# Altium schematic sheet Peripherals.SchDoc
size A4; Revision: B.2
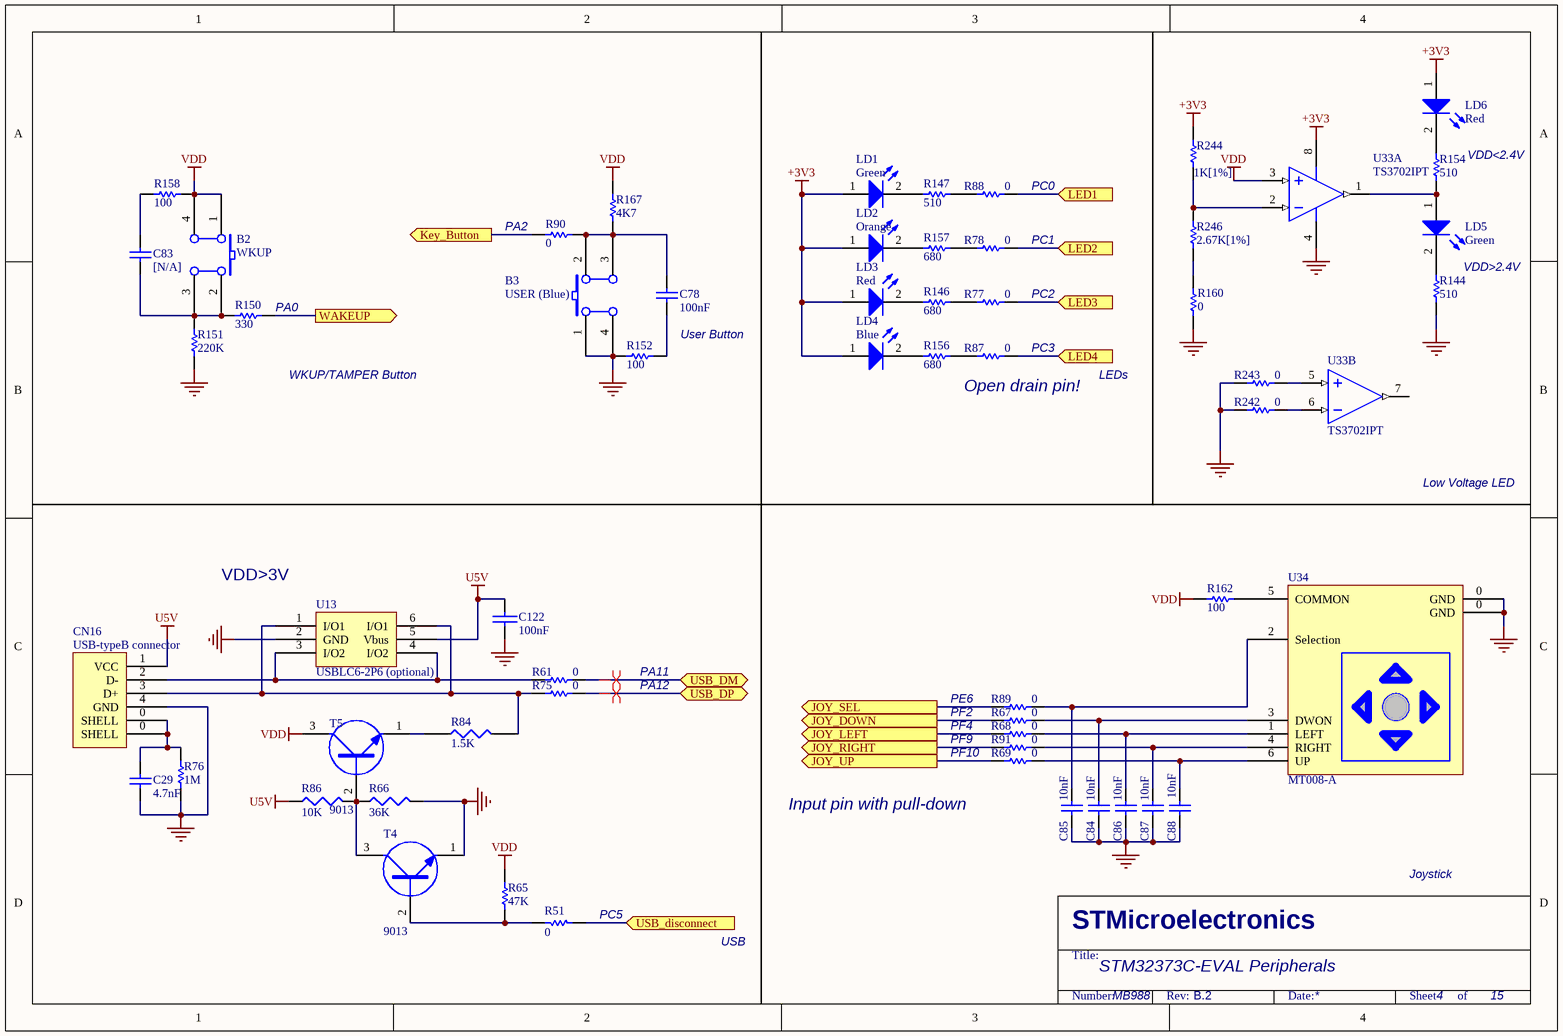
[diagram p0: Peripherals.SchDoc]

## Parts
B2  WKUP  [PB10]
B3  USER (Blue)  [PB10]
C29  4.7nF  [0603C]
C78  100nF  [0603C]
C83  [N/A]  [0603C]
C84  10nF  [0603C]
C85  10nF  [0603C]
C86  10nF  [0603C]
C87  10nF  [0603C]
C88  10nF  [0603C]
C122  100nF  [0603C]
CN16  USB-typeB connector  [USB-B]
LD1  Green  [0603D]
LD2  Orange  [0603D]
LD3  Red  [0603D]
LD4  Blue  [0603D]
LD5  Green  [0603D]
LD6  Red  [0603D]
R51  0  [0603R]
R61  0  [0603R]
R65  47K  [0603R]
R66  36K  [0603R]
R67  0  [0603R]
R68  0  [0603R]
R69  0  [0603R]
R75  0  [0603R]
R76  1M  [0603R]
R77  0  [0603R]
R78  0  [0603R]
R84  1.5K  [0603R]
R86  10K  [0603R]
R87  0  [0603R]
R88  0  [0603R]
R89  0  [0603R]
R90  0  [0603R]
R91  0  [0603R]
R144  510  [0603R]
R146  680  [0603R]
R147  510  [0603R]
R150  330  [0603R]
R151  220K  [0603R]
R152  100  [0603R]
R154  510  [0603R]
R156  680  [0603R]
R157  680  [0603R]
R158  100  [0603R]
R160  0  [0603R]
R162  100  [0603R]
R167  4K7  [0603R]
R242  0  [0603R]
R243  0  [0603R]
R244  1K[1%]  [0603R]
R246  2.67K[1%]  [0603R]
T4  9013  [SOT-23]
T5  9013  [SOT-23]
U13  USBLC6-2P6 (optional)  [SOT-666]
U33  TS3702IPT  [TSSOP8(6.4)]  (parts A,B of 2)
U34  MT008-A  [JOY]

## Ports
JOY_DOWN (out), JOY_LEFT (out), JOY_RIGHT (out), JOY_SEL (out), JOY_UP (out), Key_Button (out), LED1 (in), LED2 (in), LED3 (in), LED4 (in), USB_disconnect (in), USB_DM (bidir), USB_DP (bidir), WAKEUP (out)

## Nets
+3V3: LD1.1(A) LD2.1(A) LD3.1(A) LD4.1(A) LD6.1(A) R244.2 U33.8(V+)
GND: B3.1(A0) B3.4(A1) C29.1 C84.1 C85.1 C86.1 C87.1 C88.1 C122.2 CN16.4(GND) R66.2 R76.1 R144.2 R151.2 R152.1 R160.2 R242.2 R243.2 T4.1(E) U13.2(GND) U33.4(V-) U34.0(GND)
U5V: C122.1 CN16.1(VCC) R86.1 U13.5(Vbus)
VDD: B2.1(A0) B2.4(A1) R65.2 R158.1 R162.1 R167.2 T5.3(C) U33.3(IN+)
JOY_DOWN: R67.2 ; port JOY_DOWN
JOY_LEFT: R68.2 ; port JOY_LEFT
JOY_RIGHT: R91.2 ; port JOY_RIGHT
JOY_SEL: R89.2 ; port JOY_SEL
JOY_UP: R69.2 ; port JOY_UP
Key_Button: R90.2 ; port Key_Button
LED1: R88.1 ; port LED1
LED2: R78.1 ; port LED2
LED3: R77.1 ; port LED3
LED4: R87.1 ; port LED4
USB_disconnect: R51.2 ; port USB_disconnect
USB_DM: R61.1 ; port USB_DM
USB_DP: R75.1 ; port USB_DP
WAKEUP: R150.2 ; port WAKEUP
NetB2_2: B2.2(B0) B2.3(B1) C83.2 R150.1 R151.1
NetB3_2: B3.2(B0) B3.3(B1) C78.2 R90.1 R167.1
NetC29_2: C29.2 CN16.0(SHELL) R76.2
NetC78_1: C78.1 R152.2
NetC83_1: C83.1 R158.2
NetC84_2: C84.2 R67.1 U34.3(DWON)
NetC85_2: C85.2 R89.1 U34.2(Selection)
NetC86_2: C86.2 R68.1 U34.1(LEFT)
NetC87_2: C87.2 R91.1 U34.4(RIGHT)
NetC88_2: C88.2 R69.1 U34.6(UP)
NetCN16_2: CN16.2(D-) R61.2 U13.3(I/O2) U13.4(I/O2)
NetCN16_3: CN16.3(D+) R75.2 R84.2 U13.1(I/O1) U13.6(I/O1)
NetLD1_2: LD1.2(K) R147.2
NetLD2_2: LD2.2(K) R157.2
NetLD3_2: LD3.2(K) R146.2
NetLD4_2: LD4.2(K) R156.2
NetLD5_1: LD5.1(A) R154.2 U33.1(OUT)
NetLD5_2: LD5.2(K) R144.1
NetLD6_2: LD6.2(K) R154.1
NetR51_1: R51.1 R65.1 T4.2(B)
NetR66_1: R66.1 R86.2 T4.3(C) T5.2(B)
NetR77_2: R77.2 R146.1
NetR78_2: R78.2 R157.1
NetR84_1: R84.1 T5.1(E)
NetR87_2: R87.2 R156.1
NetR88_2: R88.2 R147.1
NetR160_1: R160.1 R246.1
NetR162_2: R162.2 U34.5(COMMON)
NetR242_1: R242.1 U33.6(IN-)
NetR243_1: R243.1 U33.5(IN+)
NetR244_1: R244.1 R246.2 U33.2(IN-)

Not connected (* = marked no-connect by the designer): U33 7(OUT)

## Layout directives
differential pair: USB_DM, USB_DP

## Notes on the sheet
- VDD<2.4V
- (near R90) PA2
- (near R88) PC0
- (near R78) PC1
- (near R150) PA0
- (near R77) PC2
- VDD>2.4V
- WKUP/TAMPER Button
- User Button
- (near R87) PC3
- LEDs
- Open drain pin!
- Low Voltage LED
- VDD>3V
- PA12
- PA11
- PF2
- PE6
- PF10
- PF9
- PF4
- Input pin with pull-down
- (near R51) PC5
- Joystick
- USB
- STM32373C-EVAL Peripherals
- MB988
- 4
- 15
- STMicroelectronics
- Title:
- Number:
- Rev:
- Date:
- Sheet       of

## Library data of the parts
B2 B3 = SW PUSHBUTTON: SE PUSHBUTTON
C29 C78 C83-C88 = CAP: Capacitor; Value: 100pF; Published: 8-Jun-2000; Revision: July-2002: Re-released for DXP Platform.; Publisher: Altium Limited
C122 = CAP: Capacitor
CN16 = USB-B
LD1-LD6 = LED2: Typical RED, GREEN, YELLOW, AMBER GaAs LED; Published: 8-Jun-2000; Revision: July-2002: Re-released for DXP Platform.; Publisher: Altium Limited
R51 R61 R65 R67-R69 R75-R78 R87-R91 R144 R146 R147 R150 R152 R154 R156-R158 R160 R162 R242-R244 R246 = Res1: Resistor; Value: 1K; Published: 8-Jun-2000; Revision: July-2002: Re-released for DXP Platform.; Publisher: Altium Limited
R66 R86 = R: Right: 20; Bottom: 30
R84 = RES1
R151 R167 = res1: Resistor; Value: 1K; Published: 8-Jun-2000; Revision: July-2002: Re-released for DXP Platform.; Publisher: Altium Limited
T4 T5 = NPN
U13 = USBLC6-2
U33 = LM393PT
U34 = MT-008A